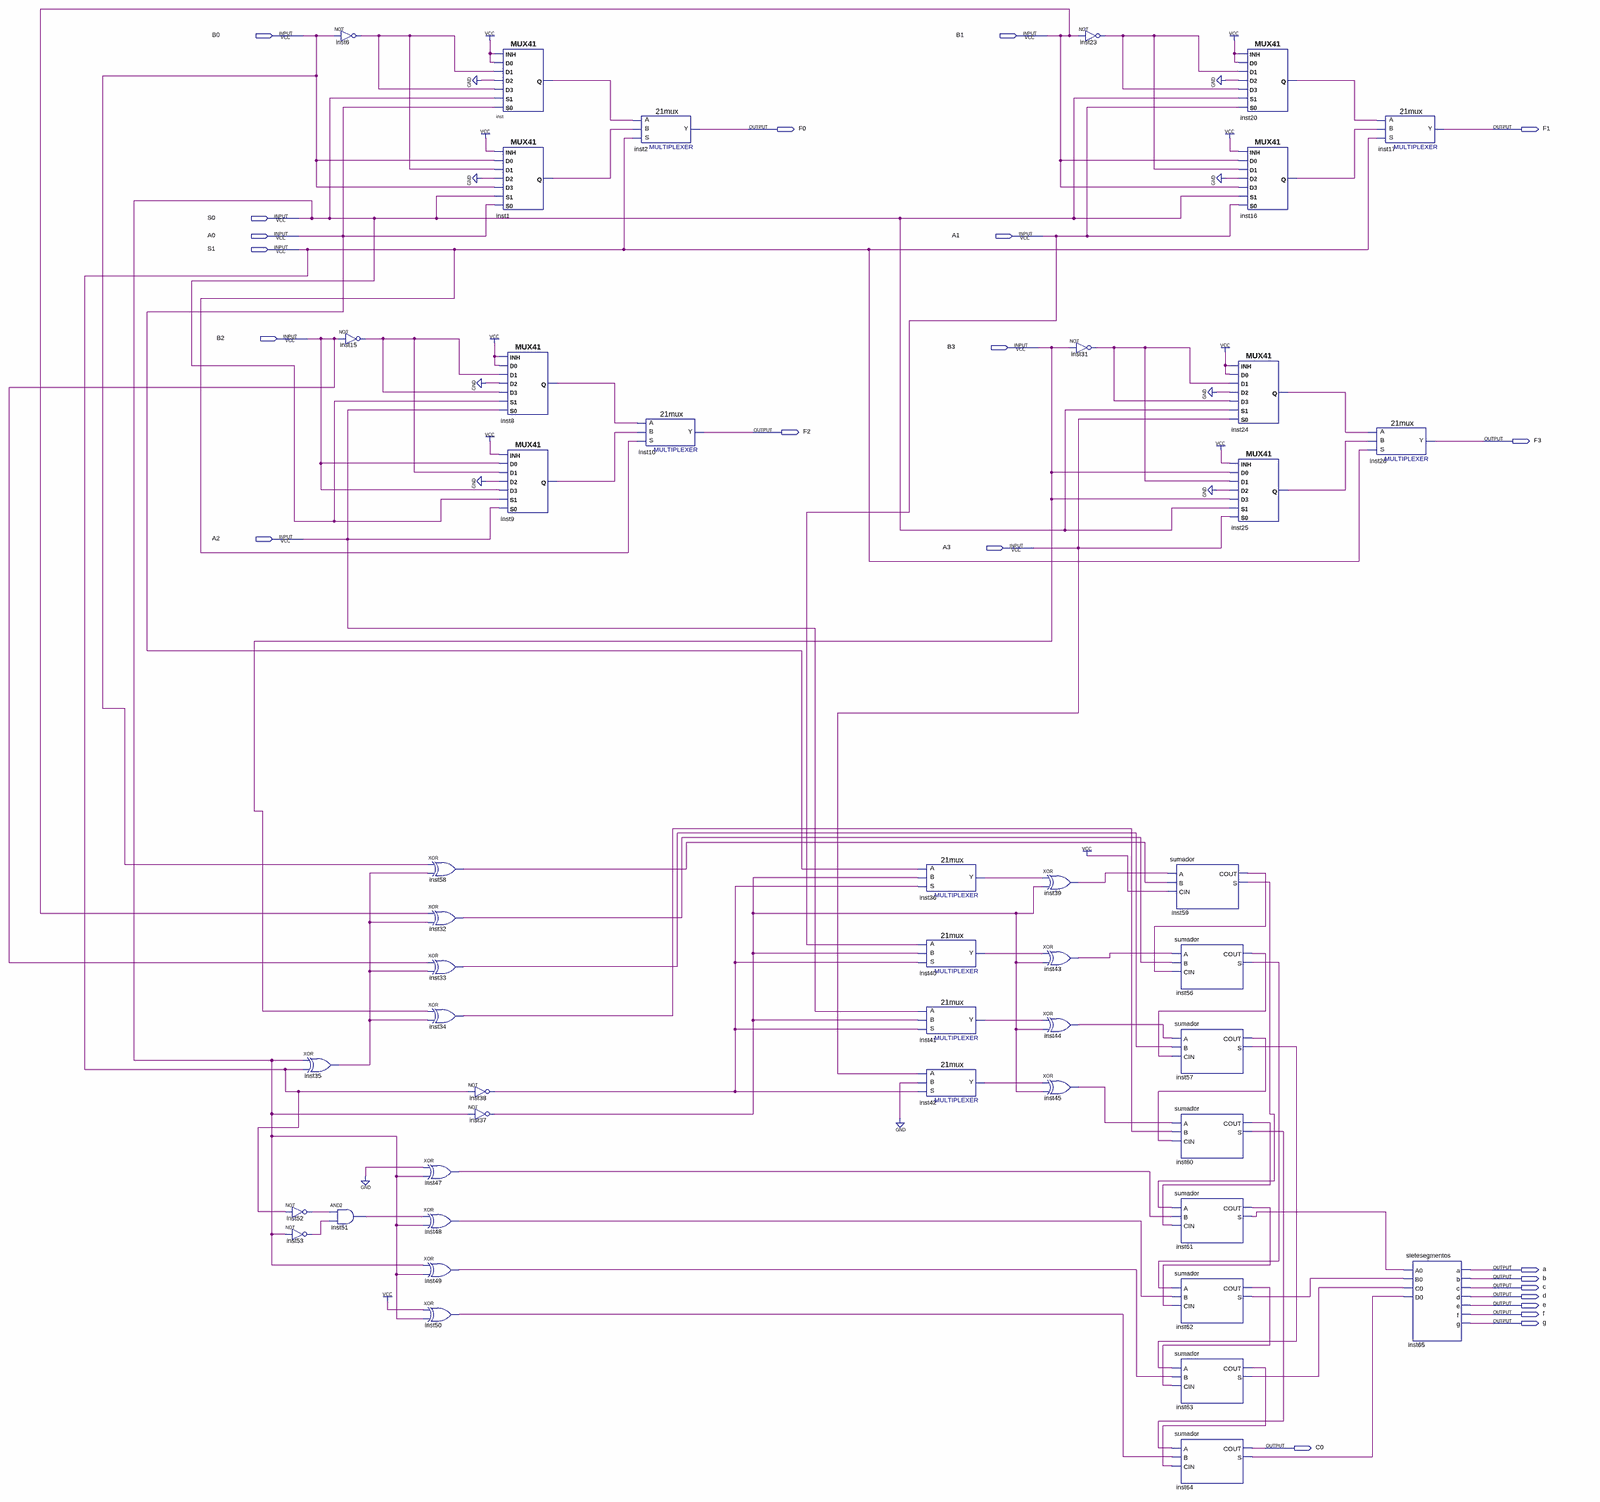
[diagram p0: schematic sheet, whole]
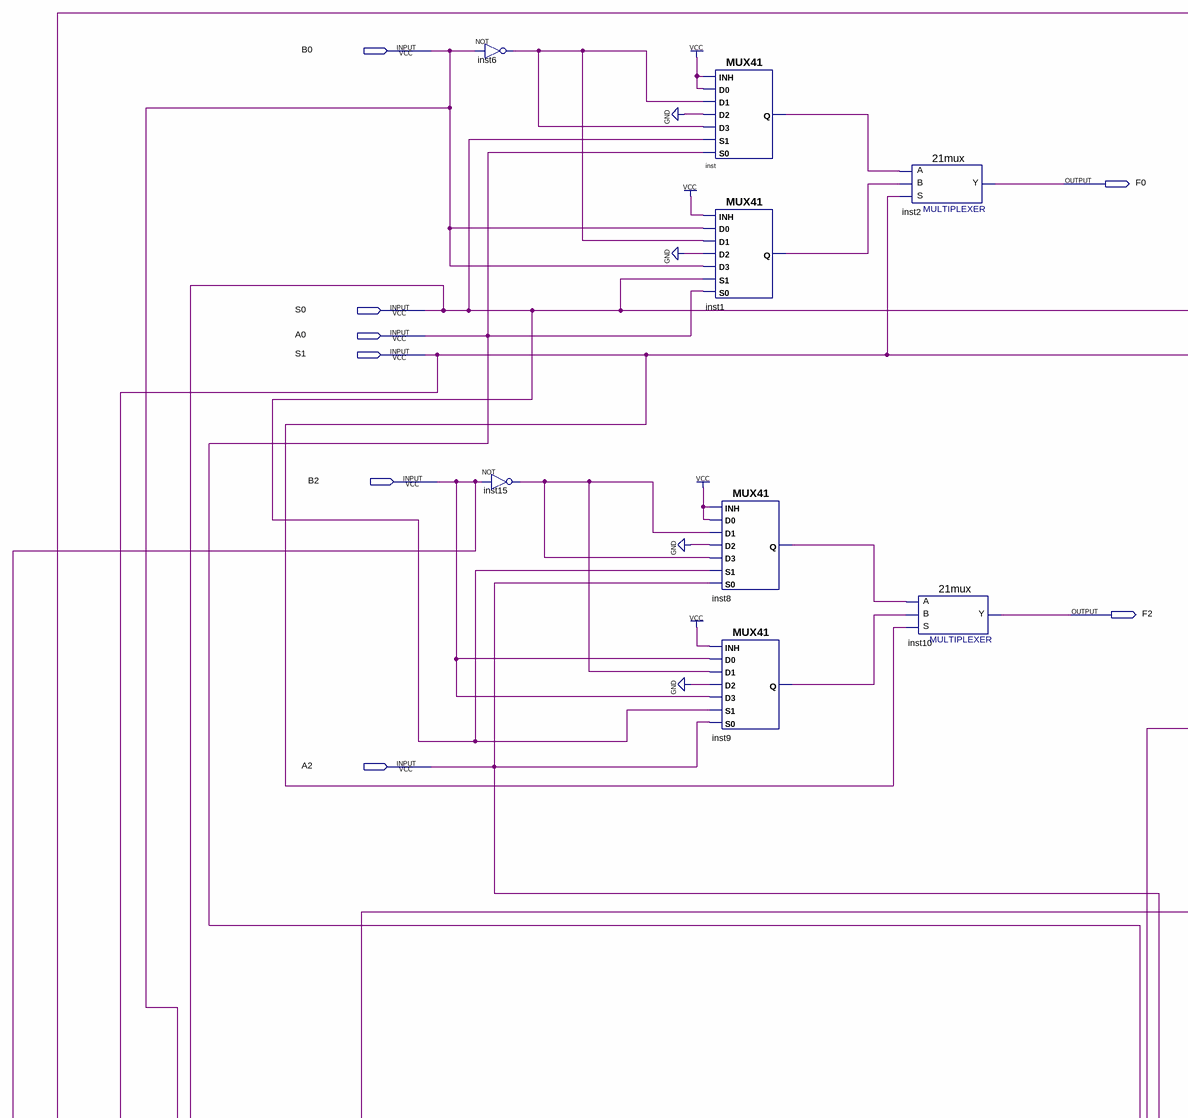
[diagram p1: schematic sheet, upper left part]
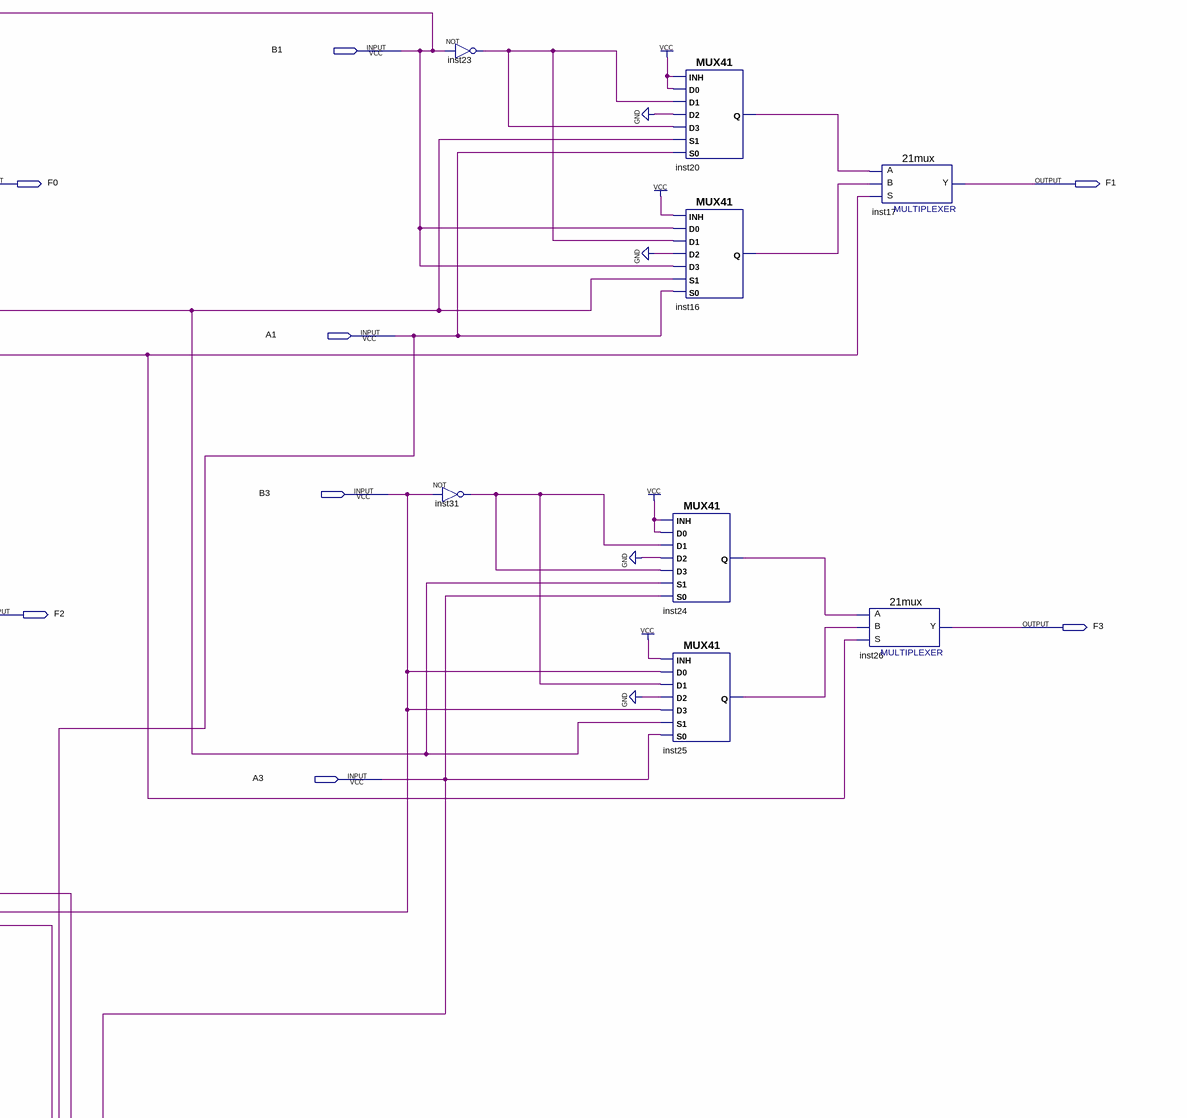
[diagram p2: schematic sheet, upper right part]
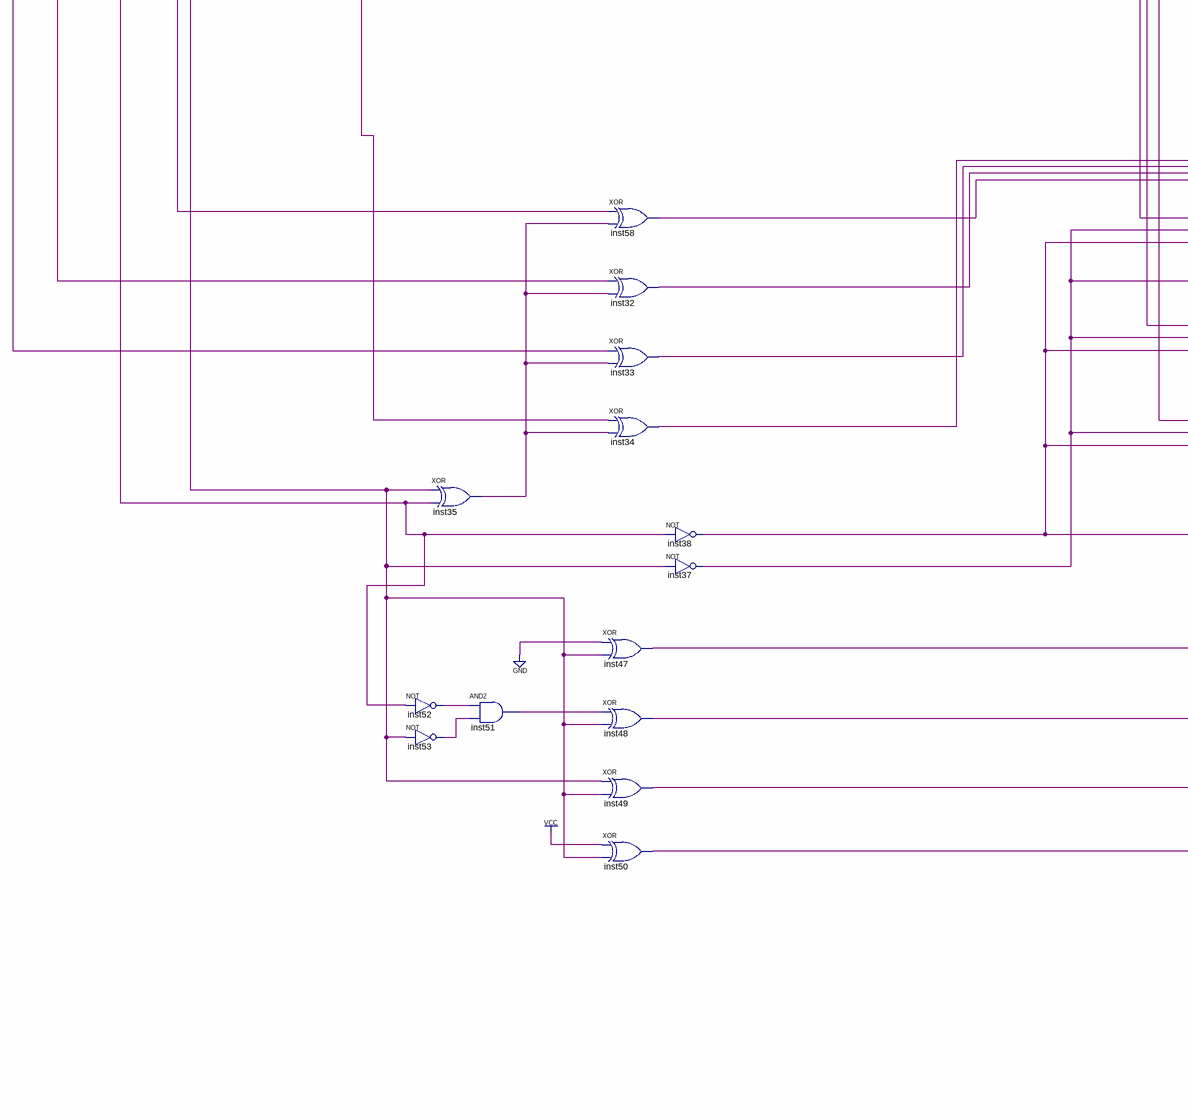
[diagram p3: schematic sheet, lower left part]
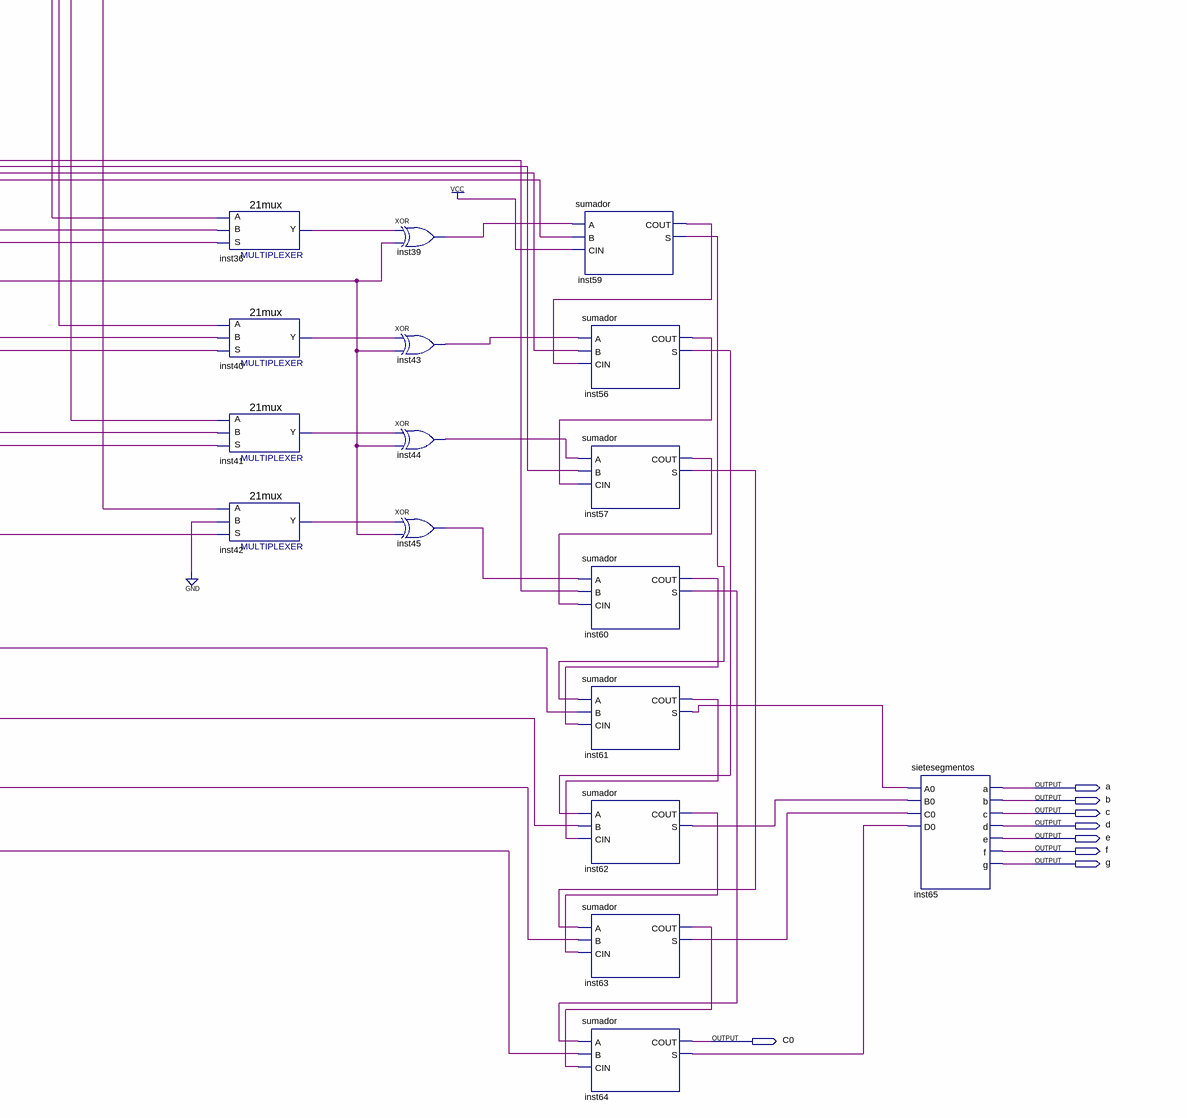
[diagram p4: schematic sheet, lower right part]
// Quartus schematic parcial_digitales.bdf as structural Verilog: 47 symbols, 22 pins
module parcial_digitales (
  input  B0,
  input  B1,
  input  S0,
  input  A0,
  input  A1,
  input  S1,
  input  B2,
  input  B3,
  input  A2,
  input  A3,
  output F0,
  output F1,
  output F2,
  output F3,
  output a,
  output b,
  output c,
  output d,
  output e,
  output f,
  output g,
  output C0
);

  wire inst1_q, inst6_out, inst8_q, inst9_q, inst15_out, inst16_q, inst20_q, inst23_out, inst24_q, inst25_q,
       inst31_out, inst32_out, inst33_out, inst34_out, inst35_out, inst36_y, inst37_out, inst38_out,
       inst39_out, inst40_y, inst41_y, inst42_y, inst43_out, inst44_out, inst45_out, inst47_out, inst48_out,
       inst49_out, inst50_out, inst51_out, inst52_out, inst53_out, inst56_cout, inst56_s, inst57_cout,
       inst57_s, inst58_out, inst59_cout, inst59_s, inst60_cout, inst60_s, inst61_cout, inst61_s,
       inst62_cout, inst62_s, inst63_cout, inst63_s, inst64_s, inst_q;

  xor inst35 (inst35_out, S0, S1);
  not inst52 (inst52_out, S1);
  not inst53 (inst53_out, S0);
  not inst6 (inst6_out, B0);
  not inst15 (inst15_out, B2);
  and inst51 (inst51_out, inst52_out, inst53_out);
  xor inst47 (inst47_out, 1'b0, S0);
  xor inst48 (inst48_out, inst51_out, S0);
  xor inst49 (inst49_out, S0, S0);
  xor inst50 (inst50_out, 1'b1, S0);
  xor inst58 (inst58_out, B0, inst35_out);
  xor inst32 (inst32_out, B1, inst35_out);
  xor inst33 (inst33_out, B2, inst35_out);
  xor inst34 (inst34_out, B3, inst35_out);
  MUX41 inst (.S0(A0), .D2(1'b0), .S1(S0), .D3(inst6_out), .D0(1'b1), .INH(1'b1), .D1(inst6_out), .Q(inst_q));
  MUX41 inst1 (.S0(A0), .D2(1'b0), .S1(S0), .D3(B0), .D0(B0), .INH(1'b1), .D1(inst6_out), .Q(inst1_q));
  not inst38 (inst38_out, S1);
  not inst37 (inst37_out, S0);
  MUX41 inst8 (.S0(A2), .D2(1'b0), .S1(S0), .D3(inst15_out), .D0(1'b1), .INH(1'b1), .D1(inst15_out), .Q(inst8_q));
  MUX41 inst9 (.S0(A2), .D2(1'b0), .S1(S0), .D3(B2), .D0(B2), .INH(1'b1), .D1(inst15_out), .Q(inst9_q));
  \21mux  inst2 (.S(S1), .B(inst1_q), .A(inst_q), .Y(F0));
  \21mux  inst10 (.S(S1), .B(inst9_q), .A(inst8_q), .Y(F2));
  \21mux  inst36 (.S(inst38_out), .B(inst37_out), .A(A0), .Y(inst36_y));
  \21mux  inst40 (.S(inst38_out), .B(inst37_out), .A(A1), .Y(inst40_y));
  \21mux  inst41 (.S(inst38_out), .B(inst37_out), .A(A2), .Y(inst41_y));
  \21mux  inst42 (.S(inst38_out), .B(1'b0), .A(A3), .Y(inst42_y));
  xor inst39 (inst39_out, inst36_y, inst37_out);
  xor inst43 (inst43_out, inst40_y, inst37_out);
  xor inst44 (inst44_out, inst41_y, inst37_out);
  xor inst45 (inst45_out, inst42_y, inst37_out);
  not inst23 (inst23_out, B1);
  not inst31 (inst31_out, B3);
  sumador inst59 (.A(inst39_out), .B(inst58_out), .CIN(1'b1), .COUT(inst59_cout), .S(inst59_s));
  sumador inst56 (.A(inst43_out), .B(inst32_out), .CIN(inst59_cout), .COUT(inst56_cout), .S(inst56_s));
  sumador inst57 (.A(inst44_out), .B(inst33_out), .CIN(inst56_cout), .COUT(inst57_cout), .S(inst57_s));
  sumador inst60 (.A(inst45_out), .B(inst34_out), .CIN(inst57_cout), .COUT(inst60_cout), .S(inst60_s));
  sumador inst61 (.A(inst59_s), .B(inst47_out), .CIN(inst60_cout), .COUT(inst61_cout), .S(inst61_s));
  sumador inst62 (.A(inst56_s), .B(inst48_out), .CIN(inst61_cout), .COUT(inst62_cout), .S(inst62_s));
  sumador inst63 (.A(inst57_s), .B(inst49_out), .CIN(inst62_cout), .COUT(inst63_cout), .S(inst63_s));
  sumador inst64 (.A(inst60_s), .B(inst50_out), .CIN(inst63_cout), .COUT(C0), .S(inst64_s));
  MUX41 inst20 (.S0(A1), .D2(1'b0), .S1(S0), .D3(inst23_out), .D0(1'b1), .INH(1'b1), .D1(inst23_out), .Q(inst20_q));
  MUX41 inst16 (.S0(A1), .D2(1'b0), .S1(S0), .D3(B1), .D0(B1), .INH(1'b1), .D1(inst23_out), .Q(inst16_q));
  MUX41 inst24 (.S0(A3), .D2(1'b0), .S1(S0), .D3(inst31_out), .D0(1'b1), .INH(1'b1), .D1(inst31_out), .Q(inst24_q));
  MUX41 inst25 (.S0(A3), .D2(1'b0), .S1(S0), .D3(B3), .D0(B3), .INH(1'b1), .D1(inst31_out), .Q(inst25_q));
  \21mux  inst17 (.S(S1), .B(inst16_q), .A(inst20_q), .Y(F1));
  \21mux  inst26 (.S(S1), .B(inst25_q), .A(inst24_q), .Y(F3));
  sietesegmentos inst65 (
    .A0(inst61_s), .B0(inst62_s), .C0(inst63_s), .D0(inst64_s), .a(a), .b(b), .c(c), .d(d), .e(e), .f(f),
    .g(g));
endmodule
